# EAGLE schematic Aegaeon REV B 20130130 PROTO (EAGLE 6.1)
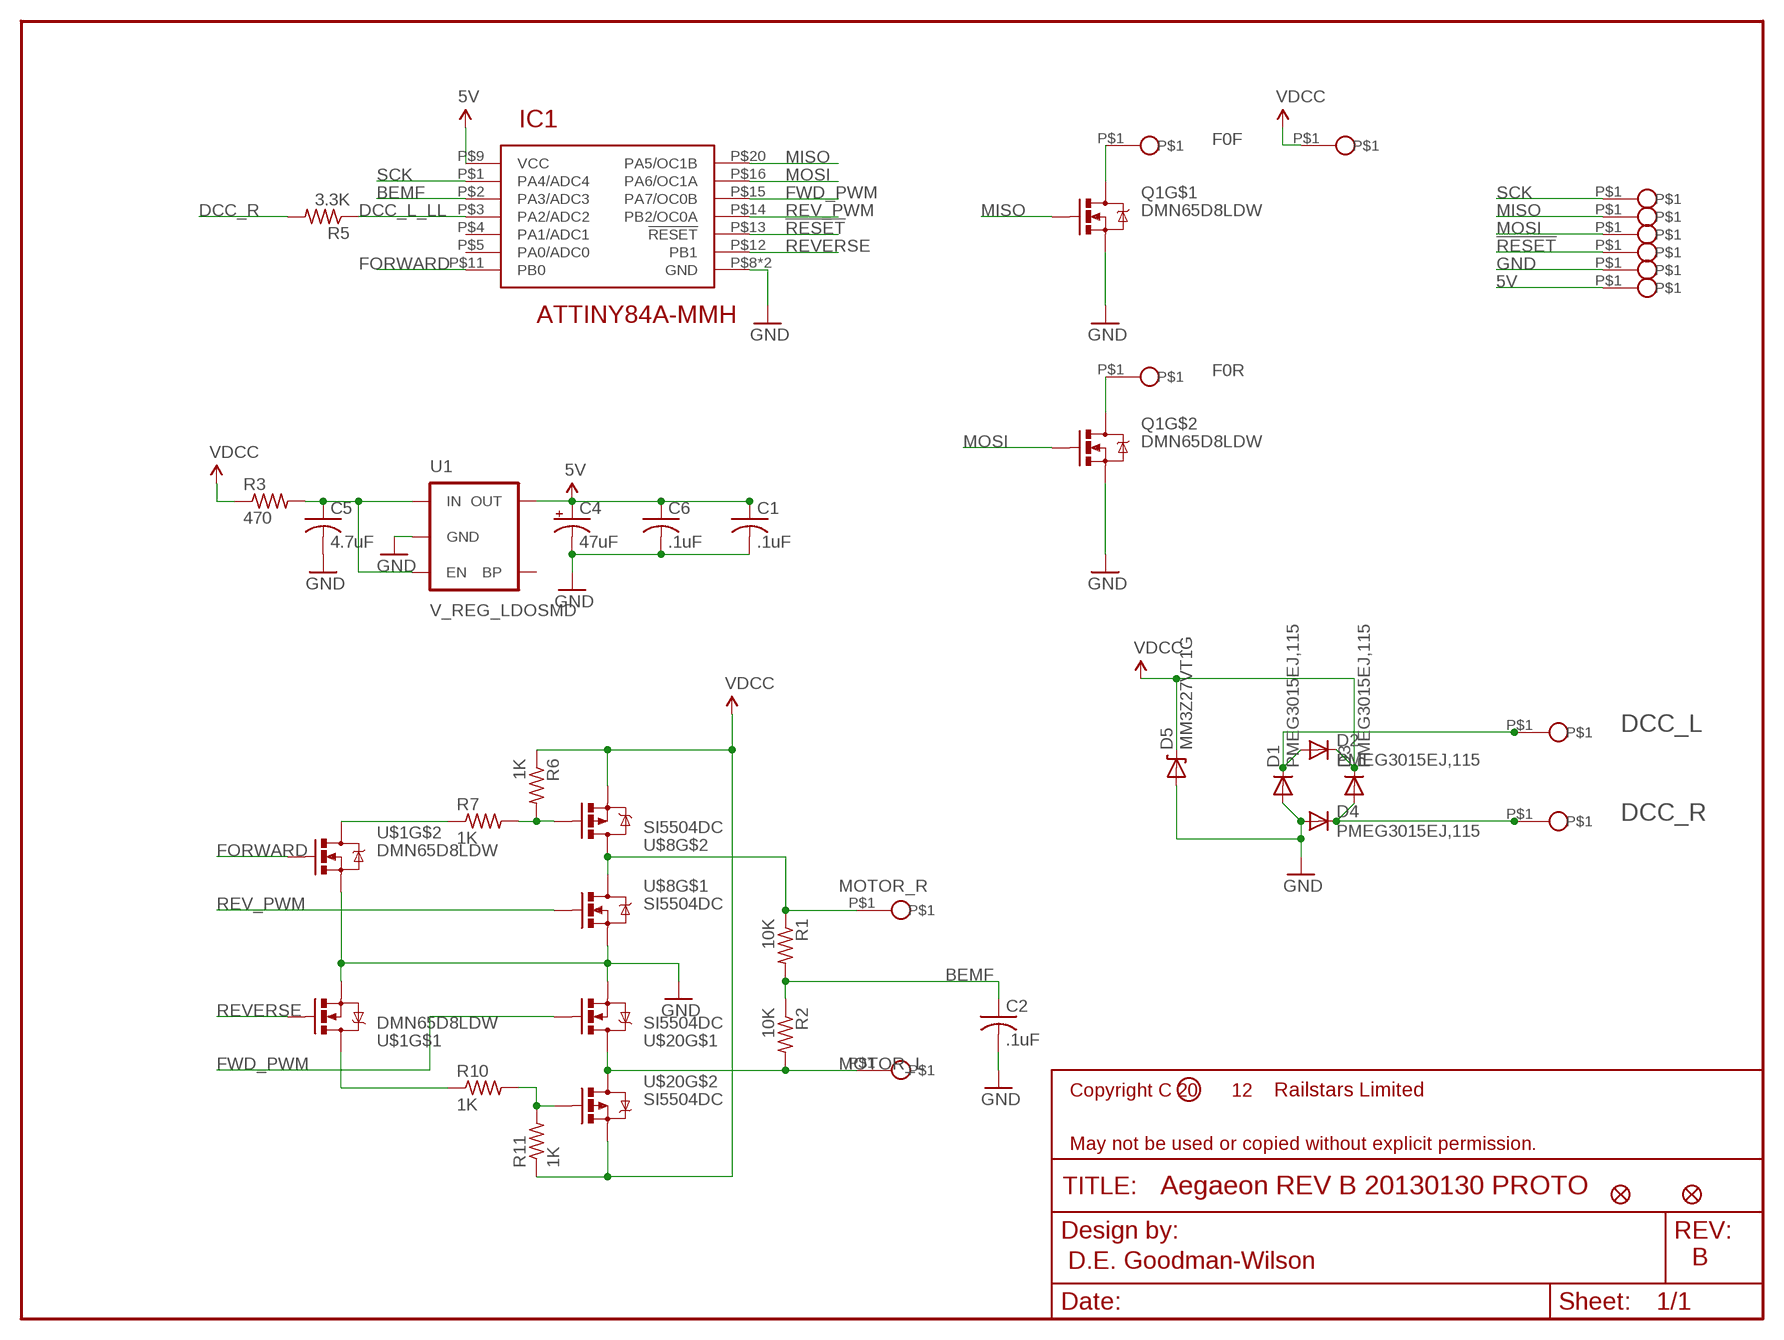
[diagram p0: schematic, sheet 1]

## Parts
C1  .1uF  C-USC0201  [C0201]
C2  .1uF  C-USC0402  [C0402]
C4  47uF  CPOL-USF980J476MMA  [CPOL0603]
C5  4.7uF  C-USC0603  [C0603]
C6  .1uF  C-USC0402  [C0402]
D1  PMEG3015EJ,115  DIODESOD  [SOD-323]
D2  PMEG3015EJ,115  DIODESOD  [SOD-323]
D3  PMEG3015EJ,115  DIODESOD  [SOD-323]
D4  PMEG3015EJ,115  DIODESOD  [SOD-323]
D5  MM3Z27VT1G  DIODE-ZENER-BZT52  [SOD-323]
DCC_L  PAD1MM  [LED_SOLDER_PAD]
DCC_R  PAD1MM  [LED_SOLDER_PAD]
IC1  ATTINY84A-MMH  [VQFN-20]
JP2  FIDUCIALUFIDUCIAL  [MICRO-FIDUCIAL]
JP4  FIDUCIALUFIDUCIAL  [MICRO-FIDUCIAL]
Q1  DMN65D8LDW  [SOT363]
R1  10K  R-US_R0201  [R0201]
R2  10K  R-US_R0201  [R0201]
R3  470  R-US_R0201  [R0201]
R5  3.3K  R-US_R0201  [R0201]
R6  1K  R-US_R0201  [R0201]
R7  1K  R-US_R0201  [R0201]
R10  1K  R-US_R0201  [R0201]
R11  1K  R-US_R0201  [R0201]
U1  V_REG_LDOSMD  [SOT23-5]
U$1  DMN65D8LDW  [SOT363]
U$2  PAD1MM  [LED_SOLDER_PAD]
U$3  PAD1MM  [LED_SOLDER_PAD]
U$5  PAD1MM  [LED_SOLDER_PAD]
U$8  SI5504DC  [1206-8]
U$10  PAD1MM  [LED_SOLDER_PAD]
U$11  PAD1MM  [LED_SOLDER_PAD]
U$14  PAD.75MM  [POGO_PAD]
U$15  PAD.75MM  [POGO_PAD]
U$16  PAD.75MM  [POGO_PAD]
U$17  PAD.75MM  [POGO_PAD]
U$18  PAD.75MM  [POGO_PAD]
U$19  PAD.75MM  [POGO_PAD]
U$20  SI5504DC  [1206-8]

## Nets
5V: C1.1 C4.1(+) C6.1 IC1.P$9(VCC) U1.5(OUT) U$19.P$1
!RESET: IC1.P$13(!RESET) U$17.P$1
BEMF: C2.1 IC1.P$2(PA3/ADC3) R1.2 R2.1
DCC_L: D1.1(C) D2.2(A) DCC_L.P$1
DCC_L_LL: IC1.P$3(PA2/ADC2) R5.1
DCC_R: D3.2(A) D4.1(C) DCC_R.P$1 R5.2
F0F: Q1.P$4(D) U$10.P$1
F0R: Q1.P$1(D) U$5.P$1
FORWARD: IC1.P$11(PB0) U$1.P$5(G)
FWD_PWM: IC1.P$15(PA7/OC0B) U$20.P$2(G)
GND: C1.2 C2.2 C4.2(-) C5.2 C6.2 D1.2(A) D4.2(A) D5.2(A) IC1.P$8(GND) IC1.P$21(GND) Q1.P$3(S) Q1.P$6(S) U1.2(GND) U$1.P$3(S) U$1.P$6(S) U$8.P$1(S) U$18.P$1 U$20.P$1(S)
MISO: IC1.P$20(PA5/OC1B) Q1.P$2(G) U$15.P$1
MOSI: IC1.P$16(PA6/OC1A) Q1.P$5(G) U$16.P$1
MOTOR_L: R2.2 U$3.P$1 U$20.P$5(D) U$20.P$6(D) U$20.P$7(D) U$20.P$8(D)
MOTOR_R: R1.1 U$2.P$1 U$8.P$5(D) U$8.P$6(D) U$8.P$7(D) U$8.P$8(D)
N$1: R6.2 R7.2 U$8.P$4(G)
N$2: C5.1 R3.2 U1.1(IN) U1.3(EN)
N$4: R10.2 R11.2 U$20.P$4(G)
N$10: R10.1 U$1.P$4(D)
N$11: R7.1 U$1.P$1(D)
REV_PWM: IC1.P$14(PB2/OC0A) U$8.P$2(G)
REVERSE: IC1.P$12(PB1) U$1.P$2(G)
SCK: IC1.P$1(PA4/ADC4) U$14.P$1
VDCC: D2.1(C) D3.1(C) D5.1(C) R3.1 R6.1 R11.1 U$8.P$3(S) U$11.P$1 U$20.P$3(S)
Unconnected: IC1.P$4(PA1/ADC1) IC1.P$5(PA0/ADC0) U1.4(BP)

## Notes on the sheet
- 12 | Railstars Limited
- D.E. Goodman-Wilson | B

## Library data of the parts
C1 C2 C5 C6 = rcl:C-US: CAPACITOR, American symbol
C4 = rcl:CPOL-US: POLARIZED CAPACITOR, American symbol
D1-D4 = Railstars:DIODE: Diode These are standard reverse protection diodes and small signal diodes. SMA package can handle up to about 1A. SOD-323 can handle about 200mA. What the SOD-323 package when ordering, there are some mfgs out there that are 5-pin packages.
D5 = SparkFun-DiscreteSemi:DIODE-ZENER: Zener Diode Production Part - 8199 3.4V Zener Voltage
DCC_L DCC_R U$2 U$3 U$5 U$10 U$11 U$14-U$19 = Railstars:PAD
IC1 = Railstars:ATTINY84A
JP2 JP4 = SparkFun-Aesthetics:FIDUCIAL: Fiducial Alignment Points Various fiducial points for machine vision alignment.
Q1 U$1 = Railstars:DMN65D8LDW
R1-R3 R5-R7 R10 R11 = rcl:R-US_: RESISTOR, American symbol
U1 = SparkFun-PowerIC:V_REG_LDO: Voltage Regulator LDO Standard 150mA LDO voltage regulator in SOT-23 layout. Micrel part MIC5205. BP (by-pass) pin is used to lower output noise with 470pF cap.
U$8 U$20 = Railstars:SI5504DC